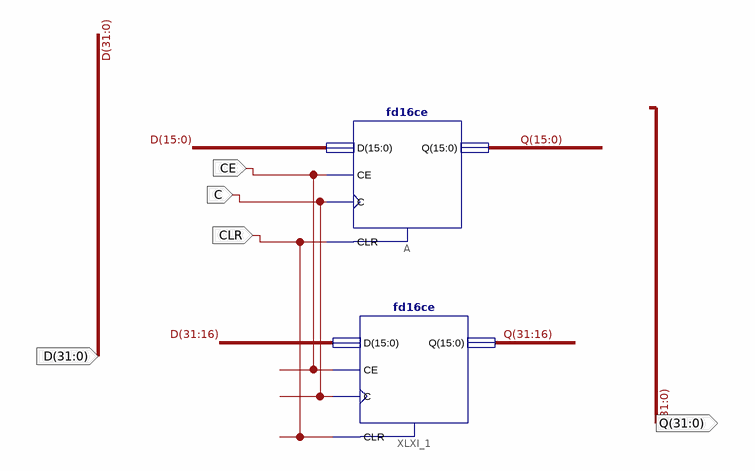
[diagram p0: schematic sheet 1]
// Xilinx ISE schematic Reg_Stack.sch (artix7) as structural Verilog: 2 symbols, 5 ports
module Reg_Stack (
  input  C,
  input  CE,
  input  CLR,
  input  [31:0] D,
  output [31:0] Q
);

  fd16ce A (.C(C), .CE(CE), .CLR(CLR), .D(D[15:0]), .Q(Q[15:0]));
  fd16ce XLXI_1 (.C(C), .CE(CE), .CLR(CLR), .D(D[31:16]), .Q(Q[31:16]));
endmodule
